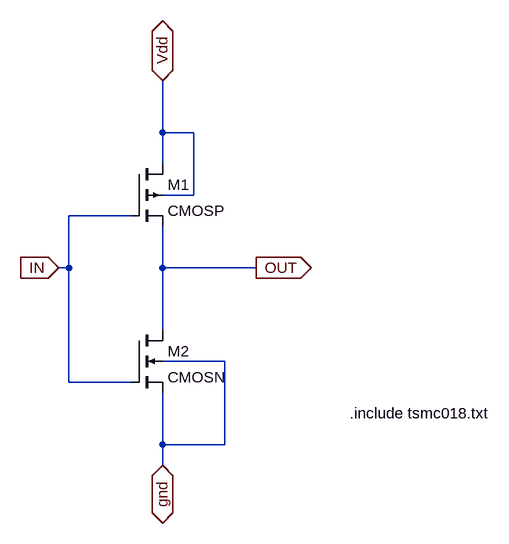
[diagram p0: schematic inv.asc]
inv.asc, the LTspice schematic file:
Version 4
SHEET 1 880 680
WIRE 64 -112 64 -192
WIRE 112 -112 64 -112
WIRE 64 -64 64 -112
WIRE 112 -16 112 -112
WIRE 112 -16 64 -16
WIRE 16 16 -80 16
WIRE -80 96 -80 16
WIRE -80 96 -96 96
WIRE 64 96 64 32
WIRE 208 96 64 96
WIRE 64 192 64 96
WIRE 160 240 64 240
WIRE -80 272 -80 96
WIRE 16 272 -80 272
WIRE 64 368 64 288
WIRE 160 368 160 240
WIRE 160 368 64 368
WIRE 64 400 64 368
FLAG -96 96 IN
IOPIN -96 96 In
FLAG 208 96 OUT
IOPIN 208 96 Out
FLAG 64 -192 Vdd
IOPIN 64 -192 BiDir
FLAG 64 400 gnd
IOPIN 64 400 BiDir
SYMBOL nmos4 16 192 R0
SYMATTR InstName M2
SYMATTR Value CMOSN
SYMATTR Value2 l=180n w=0.5u
SYMBOL pmos4 16 -64 R0
SYMATTR InstName M1
SYMATTR Value CMOSP
SYMATTR Value2 l=180n w=1u
TEXT 352 320 Left 2 !.include tsmc018.txt

The netlist it stands for:
* inv.asc
M2 OUT IN gnd gnd CMOSN l=180n w=0.5u
M1 Vdd IN OUT Vdd CMOSP l=180n w=1u
.model NMOS NMOS
.model PMOS PMOS
.lib standard.mos
.include tsmc018.txt
.backanno
.end